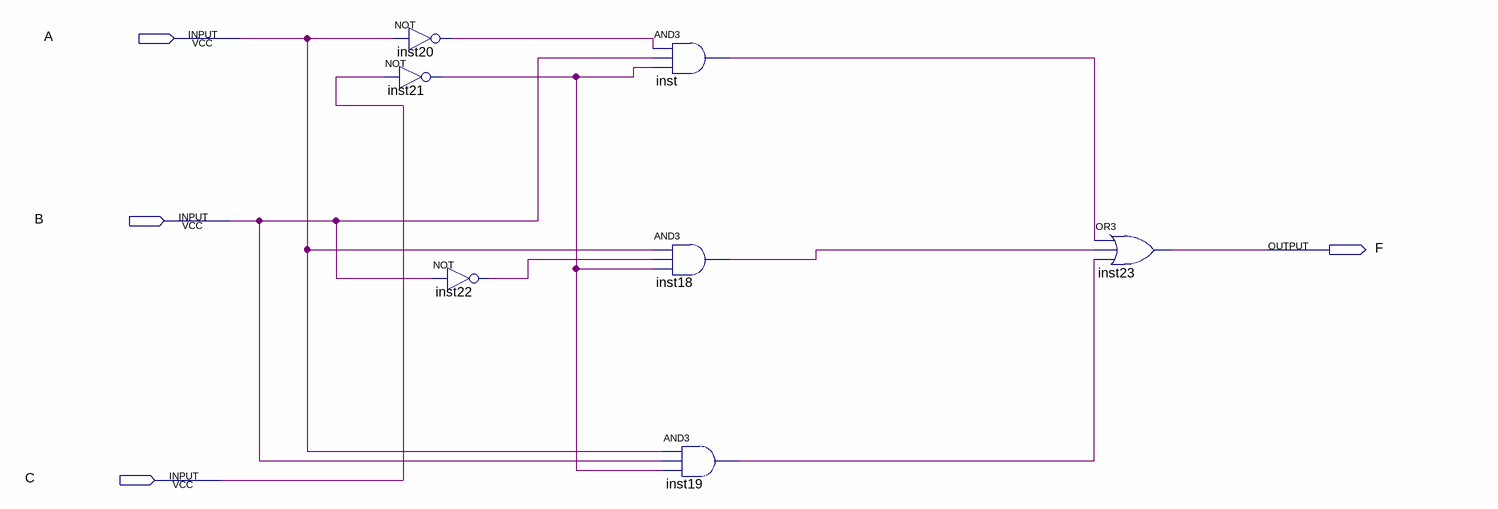
[diagram p0: schematic sheet]
// Quartus schematic Lab2Step1.bdf as structural Verilog: 7 symbols, 4 pins
module Lab2Step1 (
  input  A,
  input  B,
  input  C,
  output F
);

  wire inst18_out, inst19_out, inst20_out, inst21_out, inst22_out, inst_out;

  not inst21 (inst21_out, C);
  not inst20 (inst20_out, A);
  not inst22 (inst22_out, B);
  and inst (inst_out, inst20_out, B, inst21_out);
  and inst18 (inst18_out, A, inst22_out, inst21_out);
  and inst19 (inst19_out, A, B, inst21_out);
  or inst23 (F, inst_out, inst18_out, inst19_out);
endmodule
